# Altium schematic sheet RTC.SchDoc
size A4
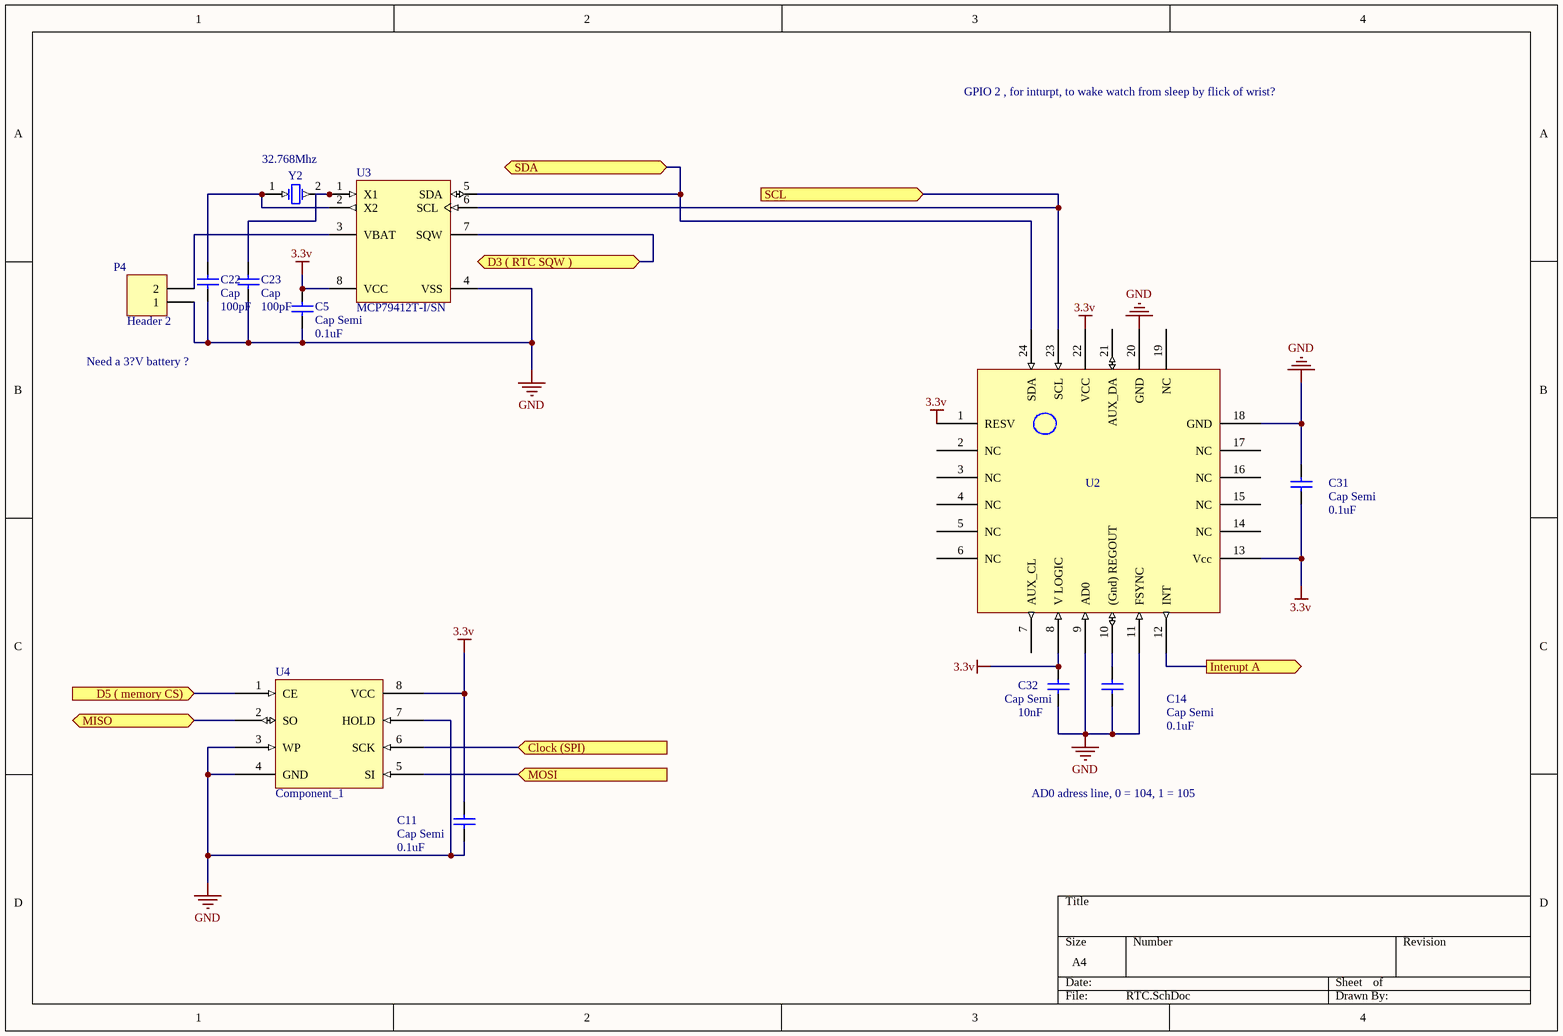
[diagram p0: RTC.SchDoc]

## Parts
C5  Cap Semi  value 0.1uF  [C1206]
C11  Cap Semi  value 0.1uF  [C1206]
C14  Cap Semi  value 0.1uF  [C1206]
C22  Cap  value 100pF  [C1206]
C23  Cap  value 100pF  [C1206]
C31  Cap Semi  value 0.1uF  [C1206]
C32  Cap Semi  value 10nF  [C1206]
P4  Header 2  [HDR1X2]
U2  Component_1  [MPU-9255]  (value not drawn)
U3  MCP79412T-I/SN  [SOIC-SN8_N]
U4  Component_1  [SOP8]
Y2  32.768Mhz  [R38]

## Ports
Clock (SPI) (in), D3 ( RTC SQW ) (bidir), D5 ( memory CS) (in), Interupt A (out), MISO (bidir), MOSI (in), SCL (in), SDA (bidir)

## Nets
3.3v: C5.2 C11.2 C31.1 C32.2 U2.1(RESV) U2.8(V_LOGIC) U2.13(Vcc) U2.22(VCC) U3.8(VCC) U4.8(VCC)
GND: C5.1 C11.1 C14.1 C22.1 C23.1 C31.2 C32.1 P4.1 U2.9(AD0) U2.11(FSYNC) U2.18(GND) U2.20(GND) U3.4(VSS) U4.3(WP) U4.4(GND) U4.7(HOLD)
Clock (SPI): U4.6(SCK) ; port Clock (SPI)
D3 ( RTC SQW ): U3.7(SQW) ; port D3 ( RTC SQW )
D5 ( memory CS): U4.1(CE) ; port D5 ( memory CS)
Interupt A: U2.12(INT) ; port Interupt A
MISO: U4.2(SO) ; port MISO
MOSI: U4.5(SI) ; port MOSI
SCL: U2.23(SCL) U3.6(SCL) ; port SCL
SDA: U2.24(SDA) U3.5(SDA) ; port SDA
NetC14_2: C14.2 U2.10((Gnd)_REGOUT)
NetC22_2: C22.2 U3.2(X2) Y2.1(OSC1)
NetC23_2: C23.2 U3.1(X1) Y2.2(OSC2)
NetP4_2: P4.2 U3.3(VBAT)

Not connected (* = marked no-connect by the designer): U2 2(NC) 3(NC) 4(NC) 5(NC) 6(NC) 7(AUX_CL) 14(NC) 15(NC) 16(NC) 17(NC) 19(NC) 21(AUX_DA)

## Notes on the sheet
- GPIO 2 , for inturpt, to wake watch from sleep by flick of wrist?
- Need a 3?V battery ?
- AD0 adress line, 0 = 104, 1 = 105

## Library data of the parts
C5 C11 C14 C31 C32 = Cap Semi: Capacitor (Semiconductor SIM Model); Published: 8-Jun-2000; LatestRevisionDate: 29-May-2009; LatestRevisionNote: IPC-7351 Footprint Added.; PackageReference: C1206; Publisher: Altium Limited; PackageDescription: Chip Capacitor
C22 C23 = Cap: Capacitor; Published: 8-Jun-2000; LatestRevisionDate: 17-Jul-2002; LatestRevisionNote: Re-released for DXP Platform.; PackageReference: RAD-0.3; Publisher: Altium Limited; PackageDescription: Radial Cap, Thru-Hole; 2 Leads; 0.3 in Pin Spacing
P4 = Header 2: Header, 2-Pin; LatestRevisionDate: 17-Jul-2002; LatestRevisionNote: Re-released for DXP Platform.; Publisher: Altium Limited
U3 = MCP79412T-I/SN: I2C Real-Time Clock/Calendar with EEPROM, SRAM, Unique ID and Battery Switchover, 8-Pin SOIC, Industrial Temperature, Tape and Reel; Manufacturer: Microchip; DatasheetVersion: revD, Dec-2011; PackageVersion: revBB, Aug-2009; PackageReference: SOIC-SN8; PackageDescription: 8-Lead Plastic Small Outline (SN) - Narrow, 3.90mm Body [SOIC]; Supplier 1: Digi-Key; Supplier Part Number 1: MCP79412T-I/SN-ND; Supplier 2: Mouser; Supplier Part Number 2: 579-MCP79412TISN; Mounting Technology: Surface Mount; PartNumber: MCP79412T-I/SN; ComponentLink1Description: Manufacturer URL; ComponentLink1URL: http://www.microchip.com/; ComponentLink2Description: Datasheet; ComponentLink2URL: http://ww1.microchip.com/downloads/en/DeviceDoc/22266D.pdf; ComponentLink3Description: Package Specification; ComponentLink3URL: http://www.microchip.com/stellent/groups/techpub_sg/documents/packagingspec/en012702.pdf; Code_JEDEC: MS-012; Code_IPC: SOIC127P600-8
Y2 = XTAL: Crystal Oscillator; Published: 8-Jun-2000; LatestRevisionDate: 17-Jul-2002; LatestRevisionNote: Re-released for DXP Platform.; PackageReference: R38; Publisher: Altium Limited; PackageDescription: Crystal, Thru-Hole; 2 Leads; Body 3.1 x 8.2 mm (Dia.xH)